# Altium schematic sheet TOP.SchDoc: =DocumentName
size A4; Organization: Queen's Formula SAE; Address1: 130 Stuart St, Kingston; Address2: Ontario; Address3: Canada; Address4: K7L 2V9; DocumentNumber: 1; Revision: 0; SheetNumber: 1; SheetTotal: 1
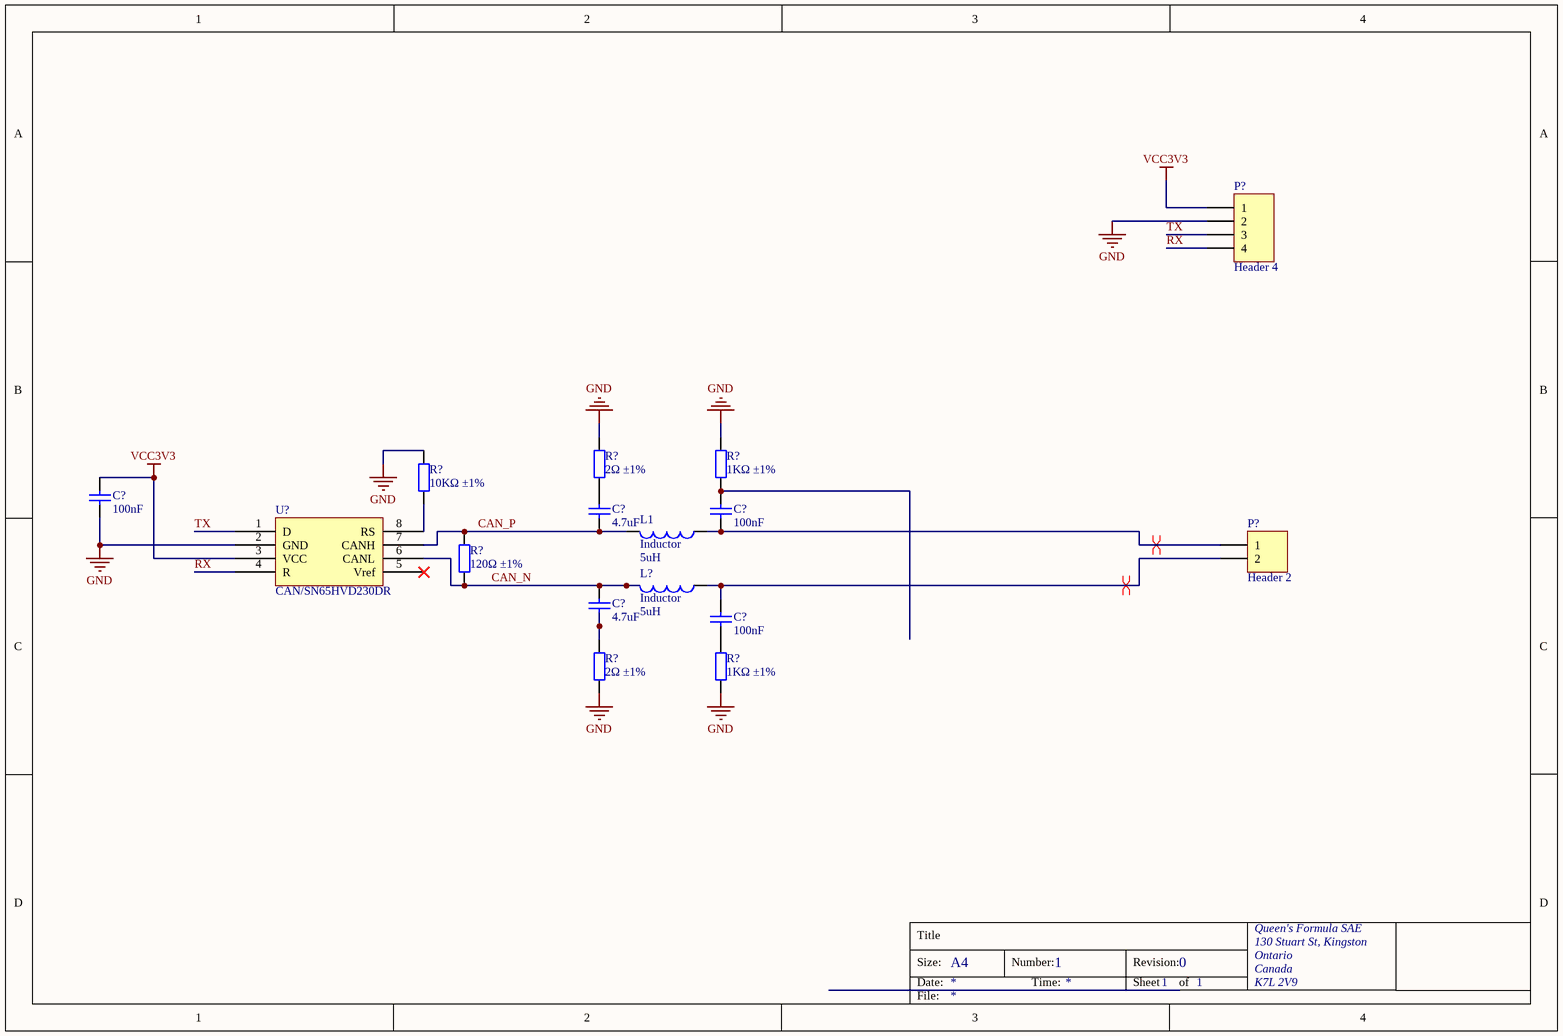
[diagram p0: TOP.SchDoc]

## Parts
(Parts that share a designator on the sheet are numbered #1, #2 ... from top to bottom, then left to right.)
C?#1  100nF  [0402_C]
C?#2  4.7uF  [0402_C]
C?#3  100nF  [0805_C]
C?#4  4.7uF  [0402_C]
C?#5  100nF  [0805_C]
L1  Inductor  value 5uH  [0402-A]
L?  Inductor  value 5uH  [0402-A]
P?#1  Header 4  [HDR1X4]
P?#2  Header 2  [HDR1X2]
R?#1  2Ω ±1%  [0603_R]
R?#2  1KΩ ±1%  [1206_R]
R?#3  10KΩ ±1%  [0402_R]
R?#4  120Ω ±1%  [0402_R]
R?#5  2Ω ±1%  [0603_R]
R?#6  1KΩ ±1%  [1206_R]
U?  CAN/SN65HVD230DR  [SOIC-8_150mil]

## Nets
GND: C?#1.1 P?#1.2 R?#1.1 R?#2.1 R?#3.2 R?#5.2 R?#6.2 U?.2(GND)
VCC3V3: C?#1.2 P?#1.1 U?.3(VCC)
CAN_N: C?#4.2 L?.2 R?#4.1 U?.6(CANL)
CAN_P: C?#2.1 L1.2 R?#4.2 U?.7(CANH)
RX: P?#1.4 U?.4(R)
TX: P?#1.3 U?.1(D)
NetC?#2_2: C?#2.2 R?#1.2
NetC?#3_1: C?#3.1 L1.1 P?#2.1
NetC?#3_2: C?#3.2 R?#2.2
NetC?#4_1: C?#4.1 R?#5.1
NetC?#5_1: C?#5.1 R?#6.1
NetC?#5_2: C?#5.2 L?.1 P?#2.2
NetR?#3_1: R?#3.1 U?.8(RS)

Not connected (* = marked no-connect by the designer): U? 5(Vref)*

## Layout directives
differential pair: NetC?#3_1, NetC?#5_2

## Notes on the sheet
- Title
- Size:
- Date:
- A4
- Number:
- Time:
- Revision:
- Sheet
- of
- File:

## Library data of the parts
C?#1 = 0402 100nF (104) 10% 16V: Chip capacitors; Manufacturer: Samsung Electro-Mechanics; PartNumber: CL05B104KO5NNNC; Tolerance: 10%; Voltage: 16V; ComponentLink1Description: Supplier link; ComponentLink1URL: http://www.szlcsc.com/product/details_1877.html; Package: 0402; Supplier: LC; SuppliersPartNumber: C1525; Capacitance: 100nF
C?#2 C?#4 = 0402 4.7uF (475) 20% 10V: Chip capacitor; Manufacturer: Samsung Electro-Mechanics; PartNumber: CL05A475MP5NRNC; Tolerance: 20%; Voltage: 10V; ComponentLink1Description: Supplier link; ComponentLink1URL: http://www.szlcsc.com/product/details_24469.html; Package: 0402; Supplier: LC; SuppliersPartNumber: C23733; Capacitance: 4.7uF
C?#3 C?#5 = 0805 100nF(104) 10% 50V: Chip capacitors; Manufacturer: YAGEO; PartNumber: CC0805KRX7R9BB104; Tolerance: 10%; Voltage: 50V; ComponentLink1Description: Supplier link; ComponentLink1URL: http://www.szlcsc.com/product/details_50686.html; Package: 0805; Supplier: LC; SuppliersPartNumber: C49678; Capacitance: 100nF
L1 L? = Inductor: Code_IEC: 1005; Published: 8-Jun-2000; LatestRevisionDate: 29-May-2009; LatestRevisionNote: IPC-7351 Footprint Added.; PackageReference: 0402-A; Publisher: Altium Limited; PackageDescription: Chip Inductor; Code_JEITA: 0402
P?#1 = Header 4: Header, 4-Pin; LatestRevisionDate: 17-Jul-2002; LatestRevisionNote: Re-released for DXP Platform.; Publisher: Altium Limited
P?#2 = Header 2: Header, 2-Pin; LatestRevisionDate: 17-Jul-2002; LatestRevisionNote: Re-released for DXP Platform.; Publisher: Altium Limited
R?#1 R?#5 = 0603 2R (2R00) 1%: Chip resistor; Manufacturer: Uniroyal Elec; PartNumber: 0603WAF200KT5E; Power: 1/10W; ComponentLink1Description: Supplier link; ComponentLink1URL: http://www.szlcsc.com/product/details_23704.html; Package: 0603; Supplier: LC; SuppliersPartNumber: C22977; Resistance: 2Ω; Tolerance: 1%
R?#2 R?#6 = 1206 1K (1001) 1%: Chip resistor; Manufacturer: Uniroyal Elec; Power: 1/4W; ComponentLink1Description: Supplier link; ComponentLink1URL: http://www.szlcsc.com/product/details_4817.html; Package: 1206; Supplier: LC; SuppliersPartNumber: C4410; Tolerance: 1%
R?#3 = 0402 10K (1002) 1%: Chip resistor; Manufacturer: Uniroyal Elec; PartNumber: 0402WGF1002TCE; Power: 1/16W; ComponentLink1Description: Supplier link; ComponentLink1URL: http://www.szlcsc.com/product/details_26487.html; Package: 0402; Supplier: LC; SuppliersPartNumber: C25744; Resistance: 10KΩ; Tolerance: 1%
R?#4 = 0402 120R (1200) 1%: Chip resistor; Manufacturer: Uniroyal Elec; PartNumber: 0402WGF1200TCE; Power: 1/16W; ComponentLink1Description: Supplier link; ComponentLink1URL: http://www.szlcsc.com/product/details_25822.html; Package: 0402; Supplier: LC; SuppliersPartNumber: C25079; Resistance: 120Ω; Tolerance: 1%
U? = CAN/SN65HVD230DR_[C12084]: CAN; ComponentLink1Description: 供应商链接; ComponentLink1URL: http://www.szlcsc.com/product/details_12661.html; Package: SOIC-8_150mil; Supplier: LC; SuppliersPartNumber: C12084